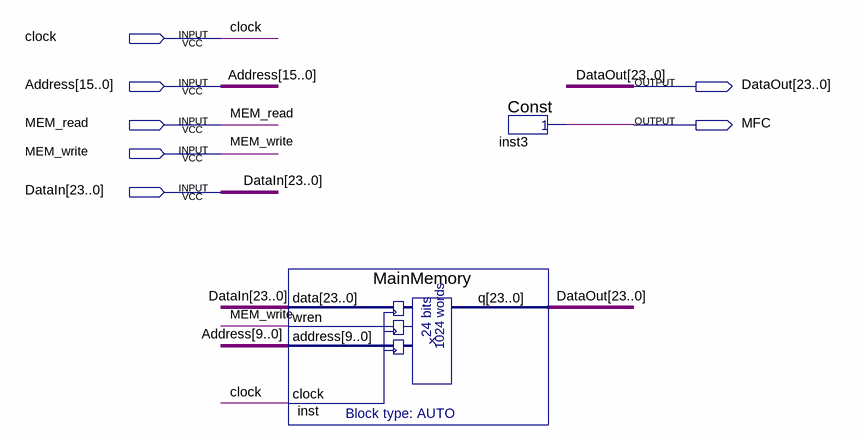
[diagram p0: schematic sheet]
// Quartus schematic MemoryInterface.bdf as structural Verilog: 2 symbols, 7 pins
module MemoryInterface (
  input  clock,
  input  [15:0] Address,
  input  MEM_read,
  input  MEM_write,
  input  [23:0] DataIn,
  output [23:0] DataOut,
  output MFC
);

  MainMemory inst (.data(DataIn), .wren(MEM_write), .address(Address[9:0]), .clock(clock), .q(DataOut));
  Const inst3 (.result(MFC));
endmodule
